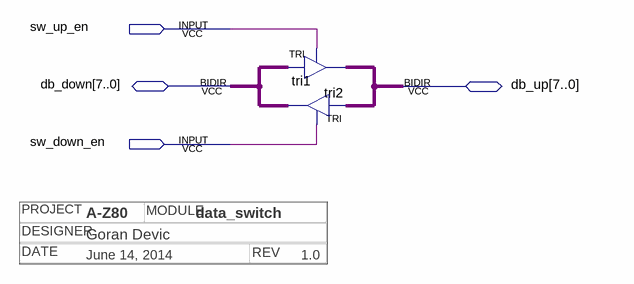
[diagram p0: schematic sheet]
// Quartus schematic data_switch.bdf as structural Verilog: 2 symbols, 4 pins
// Title block: DATE: June 14, 2014; DESIGNER: Goran Devic; MODULE: data_switch; PROJECT: A-Z80; REV: 1.0
module data_switch (
  input  sw_up_en,
  input  sw_down_en,
  inout  [7:0] db_down,
  inout  [7:0] db_up
);

  TRI \tri1 [7:0] (.IN(db_down), .OE(sw_up_en), .OUT(db_up));
  TRI tri2[7:0] (.IN(db_up), .OE(sw_down_en), .OUT(db_down));
endmodule
